# Altium schematic sheet BarGraph.SchDoc
size A
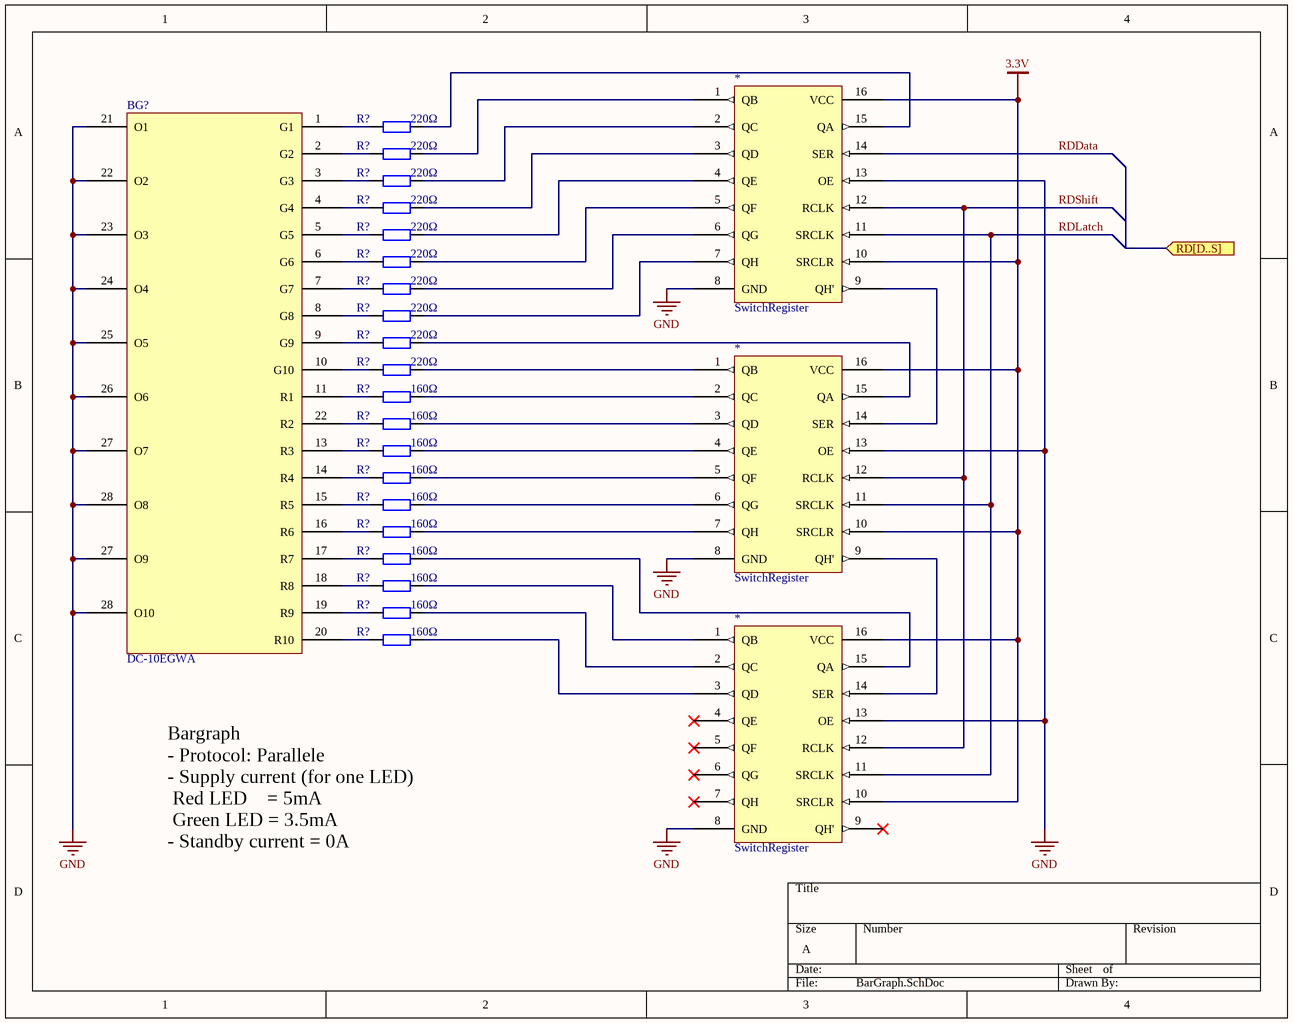
[diagram p0: BarGraph.SchDoc]

## Parts
(Parts that share a designator on the sheet are numbered #1, #2 ... from top to bottom, then left to right.)
*#1  SwitchRegister
*#2  SwitchRegister
*#3  SwitchRegister
BG?  DC-10EGWA
R?#1  220Ω  [AXIAL-0.4]
R?#2  220Ω  [AXIAL-0.4]
R?#3  220Ω  [AXIAL-0.4]
R?#4  220Ω  [AXIAL-0.4]
R?#5  220Ω  [AXIAL-0.4]
R?#6  220Ω  [AXIAL-0.4]
R?#7  220Ω  [AXIAL-0.4]
R?#8  220Ω  [AXIAL-0.4]
R?#9  220Ω  [AXIAL-0.4]
R?#10  220Ω  [AXIAL-0.4]
R?#11  160Ω  [AXIAL-0.4]
R?#12  160Ω  [AXIAL-0.4]
R?#13  160Ω  [AXIAL-0.4]
R?#14  160Ω  [AXIAL-0.4]
R?#15  160Ω  [AXIAL-0.4]
R?#16  160Ω  [AXIAL-0.4]
R?#17  160Ω  [AXIAL-0.4]
R?#18  160Ω  [AXIAL-0.4]
R?#19  160Ω  [AXIAL-0.4]
R?#20  160Ω  [AXIAL-0.4]

## Ports
RD[D..S] (in)

## Nets
3.3V: *#1.10(SRCLR) *#1.16(VCC) *#2.10(SRCLR) *#2.16(VCC) *#3.10(SRCLR) *#3.16(VCC)
GND: *#1.8(GND) *#1.13(OE) *#2.8(GND) *#2.13(OE) *#3.8(GND) *#3.13(OE) BG?.21(O1) BG?.22(O2) BG?.23(O3) BG?.24(O4) BG?.25(O5) BG?.26(O6) BG?.27(O7) BG?.28(O8)
RDData: *#1.14(SER)
RDLatch: *#1.11(SRCLK) *#2.11(SRCLK) *#3.11(SRCLK)
RDShift: *#1.12(RCLK) *#2.12(RCLK) *#3.12(RCLK)
Net*#1_1: *#1.1(QB) R?#2.2
Net*#1_2: *#1.2(QC) R?#3.2
Net*#1_3: *#1.3(QD) R?#4.2
Net*#1_4: *#1.4(QE) R?#5.2
Net*#1_5: *#1.5(QF) R?#6.2
Net*#1_6: *#1.6(QG) R?#7.2
Net*#1_7: *#1.7(QH) R?#8.2
Net*#1_9: *#1.9(QH') *#2.14(SER)
Net*#1_15: *#1.15(QA) R?#1.2
Net*#2_1: *#2.1(QB) R?#10.2
Net*#2_2: *#2.2(QC) R?#11.2
Net*#2_3: *#2.3(QD) R?#12.2
Net*#2_4: *#2.4(QE) R?#13.2
Net*#2_5: *#2.5(QF) R?#14.2
Net*#2_6: *#2.6(QG) R?#15.2
Net*#2_7: *#2.7(QH) R?#16.2
Net*#2_9: *#2.9(QH') *#3.14(SER)
Net*#2_15: *#2.15(QA) R?#9.2
Net*#3_1: *#3.1(QB) R?#18.2
Net*#3_2: *#3.2(QC) R?#19.2
Net*#3_3: *#3.3(QD) R?#20.2
Net*#3_15: *#3.15(QA) R?#17.2
NetBG?_1: BG?.1(G1) R?#1.1
NetBG?_2: BG?.2(G2) R?#2.1
NetBG?_3: BG?.3(G3) R?#3.1
NetBG?_4: BG?.4(G4) R?#4.1
NetBG?_5: BG?.5(G5) R?#5.1
NetBG?_6: BG?.6(G6) R?#6.1
NetBG?_7: BG?.7(G7) R?#7.1
NetBG?_8: BG?.8(G8) R?#8.1
NetBG?_9: BG?.9(G9) R?#9.1
NetBG?_10: BG?.10(G10) R?#10.1
NetBG?_11: BG?.11(R1) R?#11.1
NetBG?_13: BG?.13(R3) R?#13.1
NetBG?_14: BG?.14(R4) R?#14.1
NetBG?_15: BG?.15(R5) R?#15.1
NetBG?_16: BG?.16(R6) R?#16.1
NetBG?_17: BG?.17(R7) R?#17.1
NetBG?_18: BG?.18(R8) R?#18.1
NetBG?_19: BG?.19(R9) R?#19.1
NetBG?_20: BG?.20(R10) R?#20.1
NetBG?_22: BG?.22(R2) R?#12.1

Not connected (* = marked no-connect by the designer): *#3 4(QE)* 5(QF)* 6(QG)* 7(QH)* 9(QH')*

## Notes on the sheet
- Bargraph
  - Protocol: Parallele
  - Supply current (for one LED)
  Red LED    = 5mA
  Green LED = 3.5mA
  - Standby current = 0A

## Library data of the parts
*#1-*#3 BG? = Component_1
R?#1-R?#20 = Res2: Resistor; Value: 1K; Published: 8-Jun-2000; LatestRevisionDate: 17-Jul-2002; LatestRevisionNote: Re-released for DXP Platform.; PackageReference: AXIAL-0.4; Publisher: Altium Limited; PackageDescription: Axial Device, Thru-Hole; 2 Leads; 0.4 in Pin Spacing